# Altium schematic sheet BSPD_Input.SchDoc: BSPD: Input
size A4; DrawnBy: Pol Feliu; DocumentNumber: 1; Revision: 1; SheetNumber: 1; SheetTotal: 4; University: UPC EEBE; City: Barcelona; Country: Spain; CP: 08019; Address: Av. Eduard Maristany, 16
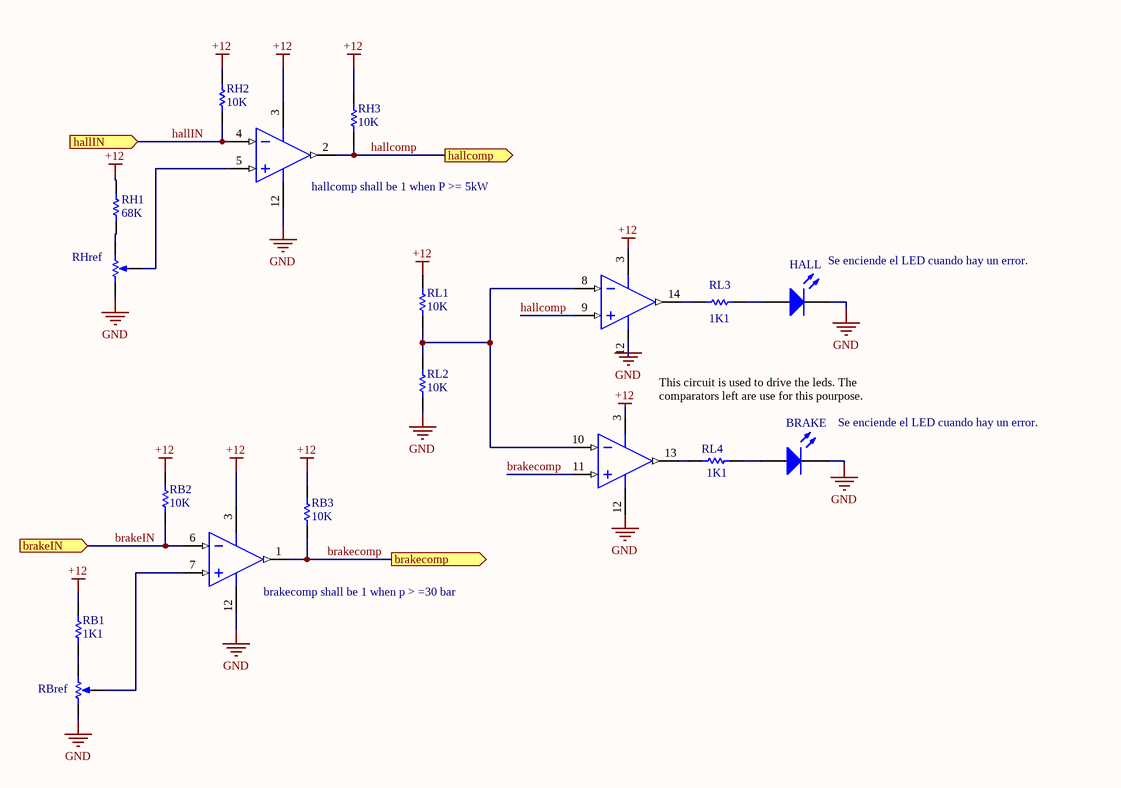
[diagram p0: BSPD_Input.SchDoc]

## Parts
BRAKE  150120BS75000  [1206_A]  (value not drawn)
HALL  150120BS75000  [1206_A]  (value not drawn)
RB1  1K1  [RESC1206(3216)_M]
RB2  10K  [RESC1206(3216)_M]
RB3  10K  [RESC1206(3216)_M]
RBref  POT Bourns 3296W 10K  [POT Bourns 3296W]  (value not drawn)
RH1  68K  [RESC1206(3216)_M]
RH2  10K  [RESC1206(3216)_M]
RH3  10K  [RESC1206(3216)_M]
RHref  POT Bourns 3296W 100K  [POT Bourns 3296W]  (value not drawn)
RL1  10K  [RESC1206(3216)_M]
RL2  10K  [RESC1206(3216)_M]
RL3  1K1  [RESC1206(3216)_M]
RL4  1K1  [RESC1206(3216)_M]
UMP1  LM339M  [D0014A_M]  (value not drawn)  (parts A,B,C,D of 4)

## Ports
brakecomp (out), brakeIN (in), hallcomp (out), hallIN (in)

## Nets
+12: RB1.2 RB2.2 RB3.2 RH1.2 RH2.2 RH3.2 RL1.2 UMP1.3(V+)
GND: BRAKE.1(K) HALL.1(K) RBref.1(CCW) RHref.1(CCW) RL2.1 UMP1.12(GND)
brakecomp: RB3.1 UMP1.1(OUT2) UMP1.11(IN4+) ; port brakecomp
brakeIN: RB2.1 UMP1.6(IN2-) ; port brakeIN
hallcomp: RH3.1 UMP1.2(OUT1) UMP1.9(IN3+) ; port hallcomp
hallIN: RH2.1 UMP1.4(IN1-) ; port hallIN
NetBRAKE_2: BRAKE.2(A) RL4.2
NetHALL_2: HALL.2(A) RL3.2
NetRB1_1: RB1.1 RBref.3(CW)
NetRBref_2: RBref.2(WIPER) UMP1.7(IN2+)
NetRH1_1: RH1.1 RHref.3(CW)
NetRHref_2: RHref.2(WIPER) UMP1.5(IN1+)
NetRL1_1: RL1.1 RL2.2 UMP1.8(IN3-) UMP1.10(IN4-)
NetRL3_1: RL3.1 UMP1.14(OUT3)
NetRL4_1: RL4.1 UMP1.13(OUT4)

## Notes on the sheet
- (near UMP1) hallcomp shall be 1 when P >= 5kW
- (near HALL) Se enciende el LED cuando hay un error.
- (near UMP1) This circuit is used to drive the leds. The comparators left are use for this pourpose.
- (near BRAKE) Se enciende el LED cuando hay un error.
- (near UMP1) brakecomp shall be 1 when p > =30 bar
- Title
- e-Tech Racing
- UPC EEBE
- Size:
- Date:
- Drawn by:
- A4
- Number:
- Time:
- Revision:
- Sheet
- of
- Av. Eduard Maristany, 16
- 08019
- Barcelona Spain
- Made with:
- Checked by:

## Library data of the parts
BRAKE = CMP-1426-00014-1: SMD mono-color Chip LED, WL-SMCW, Green; Manufacturer: Wuerth Elektronik; PartNumber: 150120GS75000; PackageReference: 1206_A; ComponentLink1Description: Manufacturer URL; ComponentLink2URL: http://katalog.we-online.com/led/datasheet/150120GS75000.pdf; ComponentLink2Description: Datasheet; Color: Green; ComponentLink1URL: http://www.we-online.com
HALL = CMP-1426-00013-1: SMD mono-color Chip LED, WL-SMCW, Red; PartNumber: 150120RS75000; Manufacturer: Wuerth Elektronik; Color: Red; ComponentLink2URL: http://katalog.we-online.com/led/datasheet/150120RS75000.pdf; ComponentLink2Description: Datasheet; ComponentLink1Description: Manufacturer URL; ComponentLink1URL: http://www.we-online.com; PackageReference: 1206_A
RB1 RL3 RL4 = CMP-1014-00075-1: 1K1 0.25W 5% 1206 (3216 Metric)  SMD; Case-EIA: 1206; Value: 1100.00 Ohm; Case-Metric: 3216; Technology: SMT; Power: 0.25 W; Tolerance: 5 %
RB2 RB3 RH2 RH3 RL1 RL2 = CMP-1014-00098-1: 10K 0.25W 5% 1206 (3216 Metric)  SMD; Value: 10000.00 Ohm; Case-Metric: 3216; Case-EIA: 1206; Power: 0.25 W; Tolerance: 5 %; Technology: SMT
RH1 = CMP-1014-00118-1: 68K 0.25W 5% 1206 (3216 Metric)  SMD; Value: 68000.00 Ohm; Case-Metric: 3216; Case-EIA: 1206; Tolerance: 5 %; Technology: SMT; Power: 0.25 W
UMP1 = CMP-0055-00762-3: Low Power Low Offset Voltage Quad Comparator, 14-pin Narrow SOIC; Manufacturer: Texas Instruments; PowerWise: N; PackageTopMarking: NSUZXYTTE#*LM339M; CompType: Amplifiers; RoHS: N; PackageDescription: Molded Package S.O., .150in Wide, 14 Lead; Code_IPC: SOIC127P600-14; Code_JEDEC: MS-012AB; ComponentLink1Description: Datasheet URL; ComponentLink1URL: http://www.ti.com/general/docs/lit/getliterature.tsp?genericPartNumber=LM339-N&fileType=pdf; PinCount: 14; Package Reference: D0014A
RBref = POT Bourns 3296W 10K: ComponentLink1Description: RS Components; ComponentLink1URL: https://es.rs-online.com/web/p/resistencias-variables/5219647/; ComponentLink2Description: Datasheet; ComponentLink2URL: https://docs-emea.rs-online.com/webdocs/069c/0900766b8069ccf4.pdf
RHref = POT Bourns 3296W 100K: ComponentLink1Description: RS Components; ComponentLink1URL: https://es.rs-online.com/web/p/resistencias-variables/5219653/; ComponentLink2Description: Datasheet; ComponentLink2URL: https://docs-emea.rs-online.com/webdocs/069c/0900766b8069ccf4.pdf